# EAGLE design ES_Daisy_Patch_SM_Init_Rev1 (EAGLE 9.6.2)
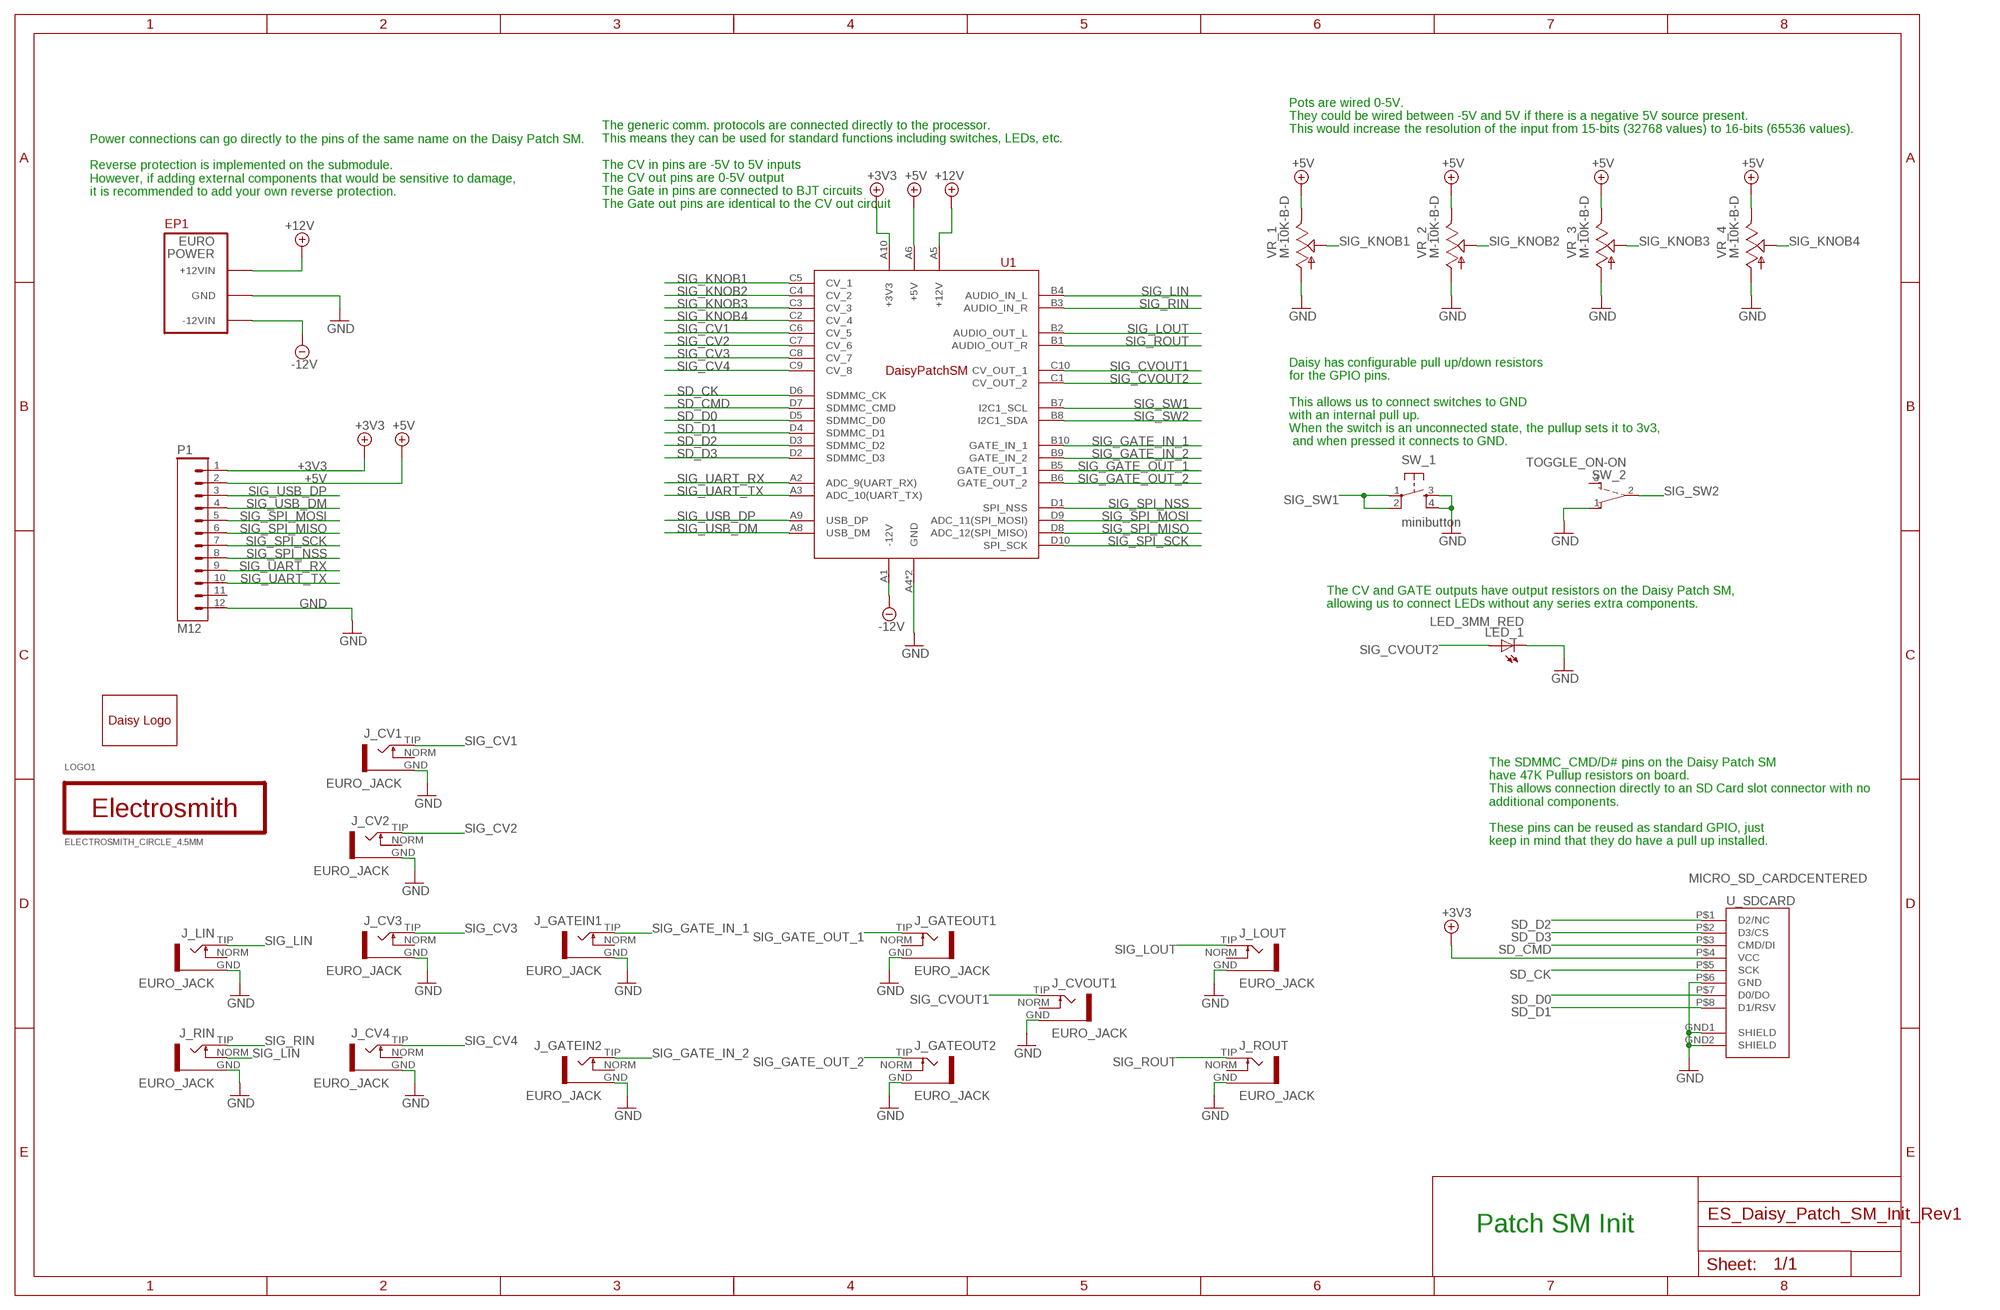
[diagram p0: schematic, sheet 1]

## Parts
EP1  EURORACK_POWERLOCK  [EURORACK_POWER_SHROUD_LOCK]
J_CV1  EURO_JACK  [S_JACK]
J_CV2  EURO_JACK  [S_JACK]
J_CV3  EURO_JACK  [S_JACK]
J_CV4  EURO_JACK  [S_JACK]
J_CVOUT1  EURO_JACK  [S_JACK]
J_GATEIN1  EURO_JACK  [S_JACK]
J_GATEIN2  EURO_JACK  [S_JACK]
J_GATEOUT1  EURO_JACK  [S_JACK]
J_GATEOUT2  EURO_JACK  [S_JACK]
J_LIN  EURO_JACK  [S_JACK]
J_LOUT  EURO_JACK  [S_JACK]
J_RIN  EURO_JACK  [S_JACK]
J_ROUT  EURO_JACK  [S_JACK]
LED_1  LED_3MM_RED  [LED]
LOGO1  ELECTROSMITH_CIRCLE_4.5MM  [ES_CIRCLE_4.5MM]
P1  M12  [1X12]
SW_1  minibutton  TAC_SWITCH_PTH_SILK  [TL1105SPF250Q_SILK]
SW_2  TOGGLE_ON-ON  [TOGGLE_ON-ON]
U1  ES_DAISY_PATCH_SM_REV1  [ES_DAISY_PATCH_SM_REV1]
U$2  DAISYLOGO  [ES_DAISY_LOGO_1]
U_SDCARD  MICRO_SD_CARDCENTERED  [VERT_MICROSD_CENTERED]
VR_1  M-10K-B-D  POT_9MM_SNAP-IN__  [9MM_SNAP-IN_POT_SILK]
VR_2  M-10K-B-D  POT_9MM_SNAP-IN__  [9MM_SNAP-IN_POT_SILK]
VR_3  M-10K-B-D  POT_9MM_SNAP-IN__  [9MM_SNAP-IN_POT_SILK]
VR_4  M-10K-B-D  POT_9MM_SNAP-IN__  [9MM_SNAP-IN_POT_SILK]

## Nets
+3V3 [power]: P1.1 U1.A10(+3V3) U_SDCARD.P$4(VCC)
+5V [power]: P1.2 U1.A6(+5V) VR_1.3 VR_2.3 VR_3.3 VR_4.3
+12V [power]: EP1.POS1(+12VIN) EP1.POS2(+12VIN) U1.A5(+12V)
-12V [power]: EP1.NEG1(-12VIN) EP1.NEG2(-12VIN) U1.A1(-12V)
GND [power]: EP1.GND1(GND) EP1.GND2(GND) EP1.GND3(GND) EP1.GND4(GND) EP1.GND5(GND) EP1.GND6(GND) J_CV1.GND J_CV2.GND J_CV3.GND J_CV4.GND J_CVOUT1.GND J_GATEIN1.GND J_GATEIN2.GND J_GATEOUT1.GND J_GATEOUT2.GND J_LIN.GND J_LOUT.GND J_RIN.GND J_ROUT.GND LED_1.K(C) P1.12 SW_1.3 SW_1.4 SW_2.1(O) U1.A4(GND) U1.A7(GND) U_SDCARD.GND1(SHIELD) U_SDCARD.GND2(SHIELD) U_SDCARD.P$6(GND) VR_1.1 VR_2.1 VR_3.1 VR_4.1
SD_CK: U1.D6(SDMMC_CK) U_SDCARD.P$5(SCK)
SD_CMD: U1.D7(SDMMC_CMD) U_SDCARD.P$3(CMD/DI)
SD_D0: U1.D5(SDMMC_D0) U_SDCARD.P$7(D0/DO)
SD_D1: U1.D4(SDMMC_D1) U_SDCARD.P$8(D1/RSV)
SD_D2: U1.D3(SDMMC_D2) U_SDCARD.P$1(D2/NC)
SD_D3: U1.D2(SDMMC_D3) U_SDCARD.P$2(D3/CS)
SIG_CV1: J_CV1.TIP U1.C6(CV_5)
SIG_CV2: J_CV2.TIP U1.C7(CV_6)
SIG_CV3: J_CV3.TIP U1.C8(CV_7)
SIG_CV4: J_CV4.TIP U1.C9(CV_8)
SIG_CVOUT1: J_CVOUT1.TIP U1.C10(CV_OUT_1)
SIG_CVOUT2: LED_1.A U1.C1(CV_OUT_2)
SIG_GATE_IN_1: J_GATEIN1.TIP U1.B10(GATE_IN_1)
SIG_GATE_IN_2: J_GATEIN2.TIP U1.B9(GATE_IN_2)
SIG_GATE_OUT_1: J_GATEOUT1.TIP U1.B5(GATE_OUT_1)
SIG_GATE_OUT_2: J_GATEOUT2.TIP U1.B6(GATE_OUT_2)
SIG_KNOB1: U1.C5(CV_1) VR_1.2
SIG_KNOB2: U1.C4(CV_2) VR_2.2
SIG_KNOB3: U1.C3(CV_3) VR_3.2
SIG_KNOB4: U1.C2(CV_4) VR_4.2
SIG_LIN: J_LIN.TIP J_RIN.NORM U1.B4(AUDIO_IN_L)
SIG_LOUT: J_LOUT.TIP U1.B2(AUDIO_OUT_L)
SIG_RIN: J_RIN.TIP U1.B3(AUDIO_IN_R)
SIG_ROUT: J_ROUT.TIP U1.B1(AUDIO_OUT_R)
SIG_SPI_MISO: P1.6 U1.D8(ADC_12(SPI_MISO))
SIG_SPI_MOSI: P1.5 U1.D9(ADC_11(SPI_MOSI))
SIG_SPI_NSS: P1.8 U1.D1(SPI_NSS)
SIG_SPI_SCK: P1.7 U1.D10(SPI_SCK)
SIG_SW1: SW_1.1 SW_1.2 U1.B7(I2C1_SCL)
SIG_SW2: SW_2.2(P) U1.B8(I2C1_SDA)
SIG_UART_RX: P1.9 U1.A2(ADC_9(UART_RX))
SIG_UART_TX: P1.10 U1.A3(ADC_10(UART_TX))
SIG_USB_DM: P1.4 U1.A8(USB_DM)
SIG_USB_DP: P1.3 U1.A9(USB_DP)
Unconnected: J_CV1.NORM J_CV2.NORM J_CV3.NORM J_CV4.NORM J_CVOUT1.NORM J_GATEIN1.NORM J_GATEIN2.NORM J_GATEOUT1.NORM J_GATEOUT2.NORM J_LIN.NORM J_LOUT.NORM J_ROUT.NORM P1.11 SW_2.3(S)

## Notes on the sheet
- Pots are wired 0-5V.
  They could be wired between -5V and 5V if there is a negative 5V source present. 
  This would increase the resolution of the input from 15-bits (32768 values) to 16-bits (65536 values).
- Power connections can go directly to the pins of the same name on the Daisy Patch SM.
  
  Reverse protection is implemented on the submodule. 
  However, if adding external components that would be sensitive to damage, 
  it is recommended to add your own reverse protection.
- The generic comm. protocols are connected directly to the processor.
  This means they can be used for standard functions including switches, LEDs, etc.
  
  The CV in pins are -5V to 5V inputs
  The CV out pins are 0-5V output
  The Gate in pins are connected to BJT circuits
  The Gate out pins are identical to the CV out circuit
- EP1
- Daisy has configurable pull up/down resistors 
  for the GPIO pins.
  
  This allows us to connect switches to GND
  with an internal pull up. 
  When the switch is an unconnected state, the pullup sets it to 3v3,
   and when pressed it connects to GND.
- The CV and GATE outputs have output resistors on the Daisy Patch SM,
  allowing us to connect LEDs without any series extra components.
- The SDMMC_CMD/D# pins on the Daisy Patch SM 
  have 47K Pullup resistors on board.
  This allows connection directly to an SD Card slot connector with no 
  additional components.
  
  These pins can be reused as standard GPIO, just 
  keep in mind that they do have a pull up installed.
- Patch SM Init

## Library data of the parts
EP1 = Electrosmith-Connectors:EURORACK_POWER; MPN: 2x5x.1-header
J_CV1-J_CV4 J_CVOUT1 J_GATEIN1 J_GATEIN2 J_GATEOUT1 J_GATEOUT2 J_LIN J_LOUT J_RIN J_ROUT = Electrosmith-Interface:EURO_JACK
LED_1 = Electrosmith-Interface:LED; COLOR: RED; SIZE: 3MM
LOGO1 = Electrosmith-Logo:ELECTROSMITH
P1 = Electrosmith-Connectors:M12
SW_1 = Electrosmith-Interface:TAC_SWITCH_PTH: Momentary Switch Button commonly used for reset or general input. Spark Fun Electronics SKU : COM-00097; IPN: Mini Button; MPN: TL1105SPF250Q
SW_2 = Electrosmith-Interface:TOGGLE_ON-ON
U1 = Electrosmith-Boards:ES_DAISY_PATCH_SM_REV1
U$2 = Electrosmith-Logo:DAISYLOGO
U_SDCARD = Electrosmith-Interface:MICRO_SD_CARD
VR_1-VR_4 = Electrosmith-Interface:POT_9MM_SNAP-IN_: 9mm vertical snap-in pot, Alpha / Panasonic style

## Net classes
0 default: width 0.203 mm, clearance 0.254 mm
1 power: width 0.406 mm, clearance 0.406 mm

## Board
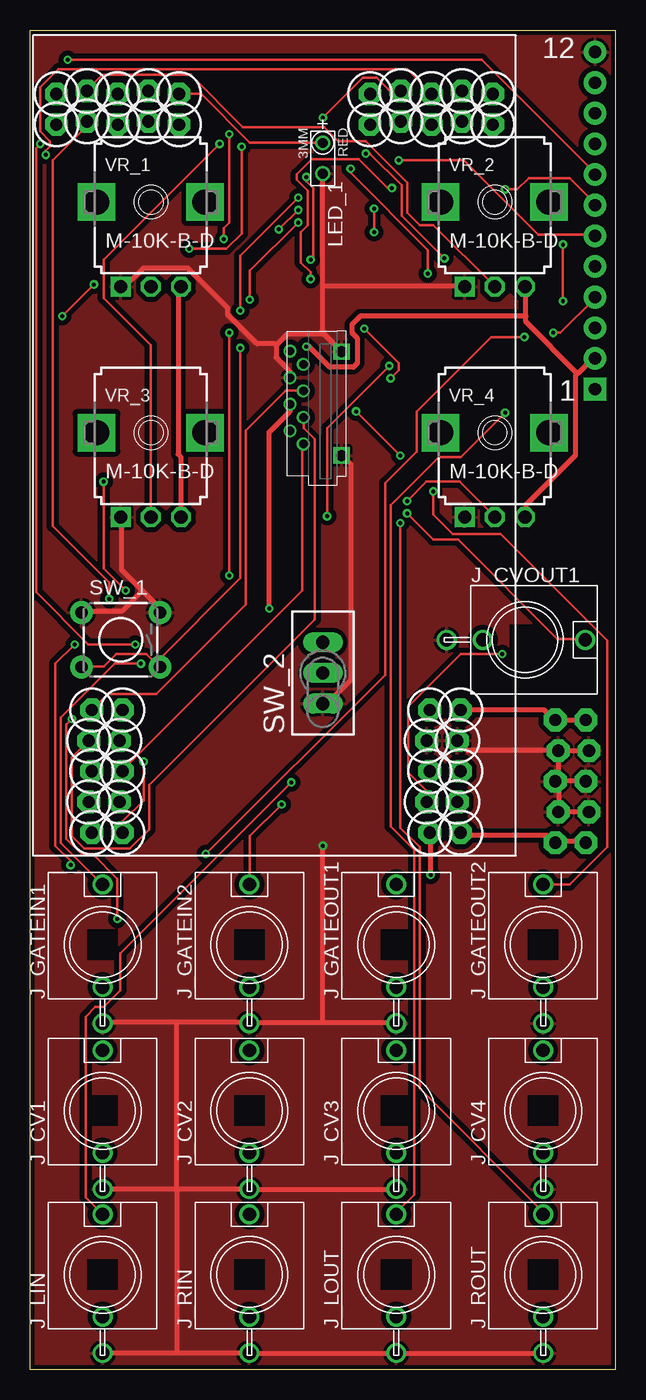
[diagram p1: board, top side]
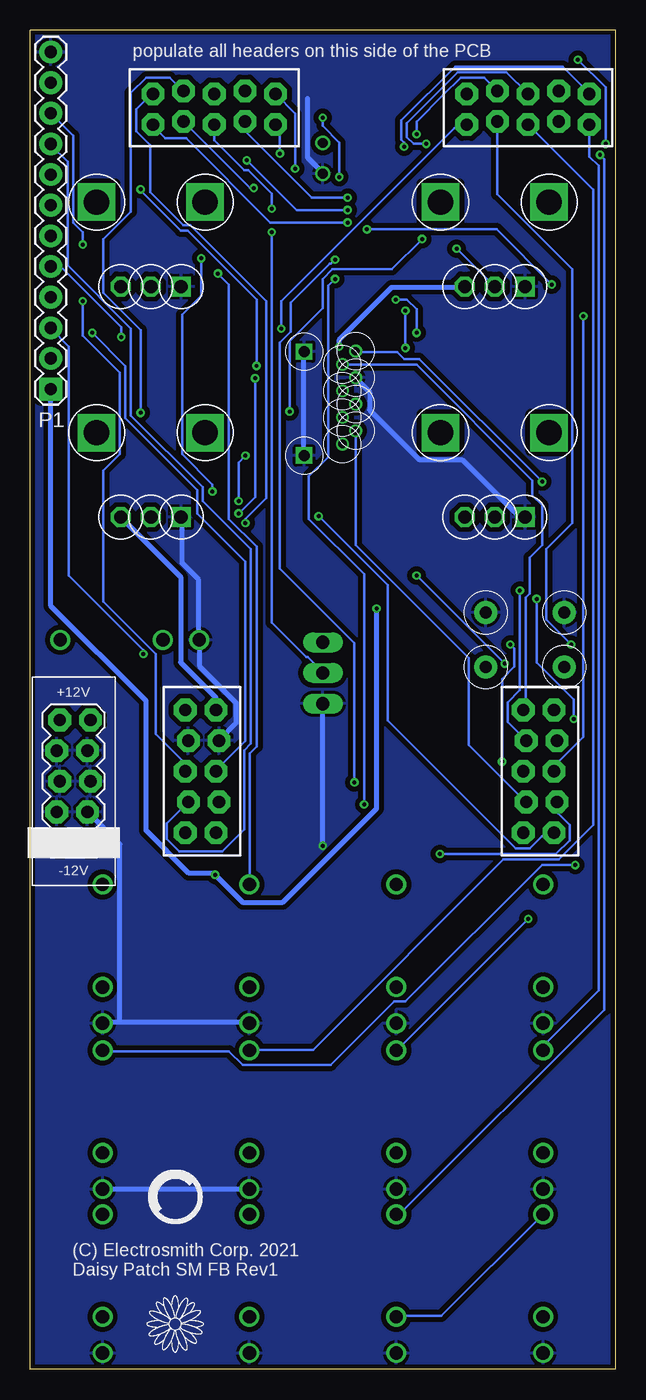
[diagram p2: board, bottom side, seen from below]

Size 48.5 x 111 mm. Coordinates in mm from the lower left corner, seen from the top.
Outline: 0,0 48.5,0 48.5,111 0,111 0,0
Copper layers (1*16): Top 0.0356mm / dielectric 1.5011mm / Bottom 0.0356mm
Design rules "ES_DRC_MaskedVias": minimum track width 6mil, minimum drill 13mil, track to track 6mil, track to pad 6mil, pad to pad 6mil, via to via 6mil, smd to smd 6mil, copper to edge 15mil, drill to drill 6mil, minimum pad ring 7mil, minimum via ring 7mil, stop-mask expansion 3mil, vias tented up to drill 16mil, thermal gap 10mil

### Footprints (pad centres in the part's own frame; a part is rotated, then mirrored left to right if it is on the bottom)
EURORACK_POWER_SHROUD_LOCK = drill 1.016 pad 1.88 octagon: GND1 -2.54,1.143; GND2 -2.54,-1.397; GND3 0,1.397; GND4 0,-1.143; GND5 2.54,1.143; GND6 2.54,-1.397; NEG1 5.08,1.397; NEG2 5.08,-1.143; POS1 -5.08,1.397; POS2 -5.08,-1.143
S_JACK = drill 1.1: GND 0,-6.5; NORM 0,-3.5; TIP 0,5
LED = drill 0.813: A -1.27,0; K 1.27,0
1X12 = drill 1.016 pad 1.88 square: 1 0,0 | drill 1.016 pad 1.88: 2 2.54,0; 3 5.08,0; 4 7.62,0; 5 10.16,0; 6 12.7,0; 7 15.24,0; 8 17.78,0; 9 20.32,0; 10 22.86,0; 11 25.4,0; 12 27.94,0
TL1105SPF250Q_SILK = drill 1.016 pad 1.88: 1 -3.251,2.261; 2 3.251,2.261; 3 -3.251,-2.261; 4 3.251,-2.261
TOGGLE_ON-ON = drill 1.1 pad 1.422 long: 1 -2.54,0; 2 0,0; 3 2.54,0
ES_DAISY_PATCH_SM_REV1 = drill 1.016 pad 1.88 octagon: A1 -32.08,-15.397; A2 -29.54,-15.143; A3 -27,-15.397; A4 -24.46,-15.143; A5 -21.92,-15.397; A6 -21.92,-12.857; A7 -24.46,-12.603; A8 -27,-12.857; A9 -29.54,-12.603; A10 -32.08,-12.857; B1 29.143,-18.08; B2 29.397,-15.54; B3 29.143,-13; B4 29.397,-10.46; B5 29.143,-7.92; B6 26.603,-7.92; B7 26.857,-10.46; B8 26.603,-13; B9 26.857,-15.54; B10 26.603,-18.08; C1 29.143,7.92; C2 29.397,10.46; C3 29.143,13; C4 29.397,15.54; C5 29.143,18.08; C6 26.603,18.08; C7 26.857,15.54; C8 26.603,13; C9 26.857,10.46; C10 26.603,7.92; D1 -32.08,12.603; D2 -29.54,12.857; D3 -27,12.603; D4 -24.46,12.857; D5 -21.92,12.603; D6 -21.92,15.143; D7 -24.46,15.397; D8 -27,15.143; D9 -29.54,15.397; D10 -32.08,15.143
VERT_MICROSD_CENTERED = drill 0.9 square: GND1 -3.9,-1.55; GND2 4.7,-1.55 | drill 0.7: P$1 -2.95,1.62; P$2 -1.85,2.72; P$3 -0.75,1.62; P$4 0.35,2.72; P$5 1.45,1.62; P$6 2.55,2.72; P$7 3.65,1.62; P$8 4.75,2.72
9MM_SNAP-IN_POT_SILK = drill 1.1 square: 1 -2.5,-7 | drill 1.1 octagon: 2 0,-7; 3 2.5,-7 | drill 2.1 square: CHASSIS1 -4.5,0; CHASSIS2 4.5,0

### Placement (x,y rotation side)
EP1  44.9,48.74 270 bottom
J_CV1  6,21.44 0 top
J_CV2  18.17,21.44 0 top
J_CV3  30.33,21.44 0 top
J_CV4  42.5,21.44 0 top
J_CVOUT1  41,60.47 270 top
J_GATEIN1  6,35.19 0 top
J_GATEIN2  18.17,35.19 0 top
J_GATEOUT1  30.33,35.19 0 top
J_GATEOUT2  42.5,35.19 0 top
J_LIN  6,7.85 0 top
J_LOUT  30.33,7.85 0 top
J_RIN  18.17,7.85 0 top
J_ROUT  42.5,7.85 0 top
LED_1  24.25,100.38 270 top
LOGO1  36.5,14.25 0 bottom
P1  46.8,81.25 90 bottom
SW_1  7.5,60.47 180 top
SW_2  24.25,57.72 90 top
U1  20.25,76.57 90 top
U$2  36.5,3.75 0 bottom
U_SDCARD  24.25,79.65 90 top
VR_1  10,96.75 0 top
VR_2  38.5,96.75 0 top
VR_3  10,77.64 0 top
VR_4  38.5,77.64 0 top

### Tracks (layer width: path | path; a pad name or v marks a point on that pad's centre or on a via)
+3V3  (via drill 0.33)
  Top 0.406: v19.8,63.06 19.8,77.69 21.52,79.4 21.52,79.97 U_SDCARD.P$4 | U1.A10 33.18,44.42 v33.18,41
  Bottom 0.406: v19.8,63.06 19.8,46.48 27.57,38.71 30.89,38.71 v33.18,41 33.29,41.11 35.35,41.11 38.89,44.66 38.89,55.4 46.78,63.29 46.78,81.23 P1.1
+5V  (via drill 0.33)
  Top 0.406: VR_3.3 12.49,70.72 12.49,75.63 12.26,75.86 12.26,89.46 12.49,89.69 VR_1.3 | 45.35,82.55 45.18,82.37 45.18,75.75 41.06,71.63 41.06,70.72 VR_4.3 | 41.06,87.29 41.06,86.83 45.35,82.55 | 41.06,87.29 41.06,89.69 VR_2.3 | v22.89,84.77 23.12,84.77 24.83,83.06 26.77,83.06 27.12,83.4 27.12,85.46 26.66,85.92 26.66,86.6 27.35,87.29 41.06,87.29 | P1.2 46.6,83.79 45.35,82.55
  Bottom 0.406: VR_4.3 40.95,70.6 36.03,65.69 36.03,58.6 33.11,55.67 U1.A6 | v22.89,84.77 22.89,85.35 18.55,89.69 12.6,89.69 VR_1.3
+12V
  Top 0.406: EP1.POS2 45.98,53.8 43.58,53.8 EP1.POS1 43.35,53.91 42.61,54.65 U1.A5
-12V
  Top 0.406: EP1.NEG2 45.98,43.74 43.58,43.74 EP1.NEG1 43.35,43.74 42.82,44.27 35.87,44.27 U1.A1
GND  (via drill 0.33)
  Top 0.406: 9.29,64.54 10.66,63.17 10.66,62.83 SW_1.3 | 9.29,64.54 7.57,66.26 7.57,70.6 VR_3.1 | 9.29,64.54 7.57,62.83 4.26,62.83 SW_1.4 | 20.37,84.89 20.37,83.86 21.52,82.72 21.52,82.26 U_SDCARD.P$6 | 20.37,84.89 21.29,85.8 24.26,85.8 | 24.26,85.8 24.38,85.8 25.75,84.43 U_SDCARD.GND2 | 24.26,85.8 24.26,89.8 | 24.26,89.8 24.26,99.06 LED_1.K | SW_2.1 24.26,55.28 24.72,55.28 26.55,57.11 26.55,75.06 25.86,75.75 U_SDCARD.GND1 | VR_1.1 7.57,89.8 7.91,89.8 9.4,91.29 13.06,91.29 16.37,87.97 16.37,87.4 18.77,85 20.26,85 20.37,84.89 | 24.26,89.8 35.92,89.8 VR_2.1 | EP1.GND3 43.58,48.77 45.98,48.77 EP1.GND4 | EP1.GND3 43.81,48.66 43.81,46.25 EP1.GND5 43.92,46.25 46.21,46.25 EP1.GND6 | EP1.GND1 43.81,51.17 43.81,48.88 EP1.GND3 | EP1.GND2 46.21,51.28 43.92,51.28 EP1.GND1 | EP1.GND1 43.58,51.28 36.22,51.28 U1.A4 | 12.14,28.77 18.09,28.77 J_GATEIN2.GND 18.32,28.77 24.26,28.77 | 12.14,28.77 6.09,28.77 J_GATEIN1.GND | 24.26,28.77 30.32,28.77 J_GATEOUT1.GND | 12.14,1.33 18.09,1.33 J_RIN.GND 18.32,1.33 30.32,1.33 J_LOUT.GND 30.43,1.33 42.43,1.33 J_ROUT.GND | 12.14,1.33 6.09,1.33 J_LIN.GND | 12.14,14.94 18.09,14.94 J_CV2.GND 18.32,14.94 30.32,14.94 J_CV3.GND | 12.14,14.94 6.09,14.94 J_CV1.GND | 12.14,14.94 12.14,1.33 | 12.14,14.94 12.14,28.77 | 24.26,28.77 v24.26,43.4
  Bottom 0.406: U_SDCARD.GND1 25.86,75.86 25.86,84.32 U_SDCARD.GND2 | 25.52,105.35 25.52,100.43 24.26,99.18 LED_1.K | VR_3.1 7.57,70.72 8.03,70.72 12.72,75.4 16.26,75.4 20.37,79.52 20.37,81 21.52,82.15 U_SDCARD.P$6 | VR_4.1 35.92,70.6 35.92,66.83 34.55,65.46 34.55,60.66 J_CVOUT1.GND 34.43,60.43 34.43,58.26 31.46,55.28 31.46,53.57 32.85,52.18 U1.A7 | 41.06,28.77 30.43,28.77 J_GATEOUT1.GND | 41.06,28.77 42.43,28.77 J_GATEOUT2.GND | J_CV4.GND 42.43,14.94 30.43,14.94 J_CV3.GND | 41.06,28.77 41.06,43.51 43.69,46.14 EP1.GND5 | v24.26,43.4 SW_2.1
  pour Top: 0.2,110.85 0.2,0.25 48.3,0.25 48.3,110.55 48.3,110.85
  pour Bottom: 0.5,110.75 0.5,0.25 48,0.25 48,110.25 48,110.75
SD_CK
  Top 0.203: U_SDCARD.P$5 22.55,81.12 21.17,81.12 17.86,77.8 17.86,63.4 10.43,55.97 6.43,55.97 U1.D6
SD_CMD
  Top 0.203: U_SDCARD.P$3 22.66,78.83 22.66,78.03 23.57,77.12 23.57,62.14 9.86,48.43 9.86,44.77 8.26,43.17 4.49,43.17 3.46,44.2 3.46,50.72 U1.D7
SD_D0
  Bottom 0.203: U_SDCARD.P$7 22.55,83.29 16.49,83.29 6.89,73.69 6.89,72.43 6.09,71.63 6.09,68.31 7.12,67.29 7.12,64.31 7.46,63.97 7.46,54.84 U1.D5
SD_D1  (via drill 0.33)
  Top 0.203: v6.09,73.57 6.09,66.37 v7.91,64.54
  Bottom 0.203: v6.09,73.57 16.26,83.75 17.52,83.75 18.09,84.32 21.52,84.32 U_SDCARD.P$8 | v7.91,64.54 7.91,56.31 8.94,55.28 8.94,53.71 8.94,53.69 8.94,53.66 U1.D4
SD_D2
  Top 0.203: U_SDCARD.P$1 22.55,76.66 22.55,64.54 7.65,49.64 U1.D3
SD_D3
  Bottom 0.203: U_SDCARD.P$2 21.52,77.69 21.52,68.31 12.14,58.94 12.14,51.74 7.43,47.03 U1.D2
SIG_CV1
  Bottom 0.203: J_CV1.TIP 5.97,26.48 5.97,26.82 1.4,31.4 1.4,99.75 2.17,100.52 U1.C6
SIG_CV2  (via drill 0.33)
  Top 0.203: v7.23,37.34 7.23,40.65 5.17,42.71 4.26,42.71 3,43.97 3,53.46 v3.46,53.91 | v6.54,63.86 6.54,65.23 1.86,69.91 1.86,100.2 4.6,102.95 4.6,103.32 U1.C7
  Bottom 0.203: v7.23,37.34 18.09,26.48 J_CV2.TIP | v3.46,53.91 3.46,55.51 6.54,58.6 v6.54,63.86
SIG_CV3
  Bottom 0.203: J_CV3.TIP 30.32,26.48 25.06,26.48 9.29,42.25 4.71,42.25 1.86,45.11 1.86,97.78 U1.C8
SIG_CV4  (via drill 0.33)
  Top 0.203: v3.34,41.8 3.34,42.14 2.09,43.4 2.09,58.48 v3.69,60.09
  Bottom 0.203: v3.34,41.8 6.09,41.8 17.4,30.48 18.32,30.48 23.57,25.22 30.89,25.22 32.03,26.37 42.43,26.37 J_CV4.TIP | v3.69,60.09 5.74,62.14 5.74,67.97 3.57,70.14 3.57,91.17 9.79,97.39 U1.C9
SIG_CVOUT1  (via drill 0.33)
  Top 0.203: v31.23,70.94 33.4,68.77 35.46,68.77 43.69,60.54 45.98,60.54 J_CVOUT1.TIP | v29.86,82.15 30.55,82.83 30.55,83.4 v27.69,86.26
  Bottom 0.203: v31.23,70.94 29.86,72.32 v29.86,82.15 | v27.69,86.26 27.69,88.55 13.38,102.86 13.17,103.06 13.06,103.17 U1.C10
SIG_CVOUT2
  Top 0.203: LED_1.A 24.15,101.69 18.2,101.69 14.18,105.71 U1.C1
SIG_GATE_IN_1  (via drill 0.33)
  Top 0.203: v9.17,58.48 7,58.48 2.54,54.03 2.54,43.63 5.97,40.2 J_GATEIN1.TIP | v16.49,85.92 v16.49,65.8 | v18.2,88.66 18.2,91.06 v22.2,95.06
  Bottom 0.203: v16.49,65.8 v9.17,58.48 | v16.49,85.92 16.49,87.86 17.29,88.66 v18.2,88.66 | v22.2,95.06 28.6,95.06 35.58,102.03 37.29,102.03 38.33,103.07 U1.B10
SIG_GATE_IN_2  (via drill 0.33)
  Top 0.203: v20.83,46.83 18.2,44.2 18.2,40.2 J_GATEIN2.TIP | v23.23,90.38 23.23,90.95 22.43,91.75 22.43,94.26 23,94.83 23,97.69 22.09,98.61 22.09,99.06 23.35,100.32 27.23,100.32 29.63,97.92 v29.98,97.92
  Bottom 0.203: v20.83,46.83 20.83,65.91 25.4,70.49 25.4,74.03 23.8,75.63 23.8,89.8 v23.23,90.38 | U1.B9 30.28,97.92 v29.98,97.92
SIG_GATE_OUT_1  (via drill 0.33)
  Top 0.203: v32.95,90.83 32.95,92.78 26.55,99.18 v26.55,99.52
  Bottom 0.203: v32.95,90.83 32.03,89.92 32.03,70.49 29.75,68.2 29.75,51.63 30.32,51.06 30.32,40.2 J_GATEOUT1.TIP | v26.55,99.52 26.55,104.09 U1.B5
SIG_GATE_OUT_2  (via drill 0.33)
  Top 0.203: v33.4,72.77 33.4,70.83 35.01,69.23 39.01,69.23 47.81,60.43 47.81,43.28 44.72,40.2 42.55,40.2 J_GATEOUT2.TIP | v34.32,92.09 30.77,95.63 30.77,98.15 28.15,100.78 v27.8,100.78
  Bottom 0.203: v33.4,72.77 33.4,73.34 35.92,75.86 35.92,87.4 34.32,89 v34.32,92.09 | v27.8,100.78 27.8,102.72 28.17,103.09 U1.B6
SIG_KNOB1  (via drill 0.33)
  Top 0.203: v13.17,92.89 16.26,92.89 17.52,94.15 v17.52,101.35
  Bottom 0.203: v13.17,92.89 10.09,89.8 VR_1.2 | v17.52,101.35 17.52,101.69 17.75,101.92 17.75,103.52 13.29,107.98 4.37,107.98 2.17,105.78 U1.C5
SIG_KNOB2
  Top 0.203: VR_2.2 38.43,89.8 33.4,94.83 32.26,94.83 31.23,95.86 31.23,98.38 27.8,101.81 25.52,101.81 24.38,102.95 17.63,102.95 13.29,107.29 5.97,107.29 4.71,106.03 U1.C4
SIG_KNOB3  (via drill 0.33)
  Top 0.203: v15.69,101.58 6.09,91.97 6.09,88.78 9.97,84.89 9.97,70.72 VR_3.2
  Bottom 0.203: v15.69,101.58 16.72,101.58 17.29,102.15 17.29,103.29 13.06,107.52 9.06,107.52 U1.C3
SIG_KNOB4  (via drill 0.33)
  Top 0.203: v31.23,71.97 32.83,73.57 35.58,73.57 38.43,70.72 VR_4.2 | v27,79.4 v30.66,75.75 | v16.03,93.69 16.03,94.6 16.49,95.06 v16.49,102.38
  Bottom 0.203: v31.23,71.97 31.23,75.17 v30.66,75.75 | v27,79.4 27,85.23 24.26,87.97 24.26,90.38 23.46,91.17 18.55,91.17 v16.03,93.69 | v16.49,102.38 16.49,103.41 14.26,105.64 12.83,107.06 10.89,107.06 U1.C2
SIG_LIN  (via drill 0.33)
  Top 0.203: v24.26,103.75 27.57,107.06 28.72,107.06 29.66,106.12 29.75,106.03 29.81,105.97 U1.B4 | v22.89,98.83 22.89,98.49 23.46,97.92 23.46,92.2 v23.23,91.97 | v21.63,48.66 7.46,34.48 7.46,31.4 6.09,30.03 5.4,30.03 4.6,29.22 4.6,14.25 5.97,12.88 J_LIN.TIP
  Bottom 0.203: J_RIN.NORM 18.09,4.42 14.43,4.42 6.09,12.77 J_LIN.TIP | v24.26,103.75 24.26,103.06 22.89,101.69 v22.89,98.83 | v23.23,91.97 23.57,91.63 23.69,91.63 26.89,88.43 26.89,86.03 27.8,85.12 27.8,66.37 21.63,60.2 v21.63,48.66
SIG_LOUT  (via drill 0.33)
  Top 0.203: v39.35,79.29 35.69,75.63 33.86,75.63 29.86,71.63 29.86,45 31.8,43.06 31.8,14.48 30.43,13.11 30.43,12.88 J_LOUT.TIP
  Bottom 0.203: v39.35,79.29 39.35,86.15 42.43,89.23 42.43,93.69 40.15,95.98 40.15,105.81 38.89,107.06 36.94,107.06 35.85,105.97 U1.B2
SIG_RIN  (via drill 0.33)
  Top 0.203: v1.29,100.66 1.29,101 1.63,101.35 1.63,101.81 0.83,102.61 0.83,106.26 2.31,107.75 31.23,107.75 33.25,105.73 U1.B3
  Bottom 0.203: v1.29,100.66 0.94,100.32 0.94,29.8 17.86,12.88 18.09,12.88 J_RIN.TIP
SIG_ROUT  (via drill 0.33)
  Top 0.203: v30.66,70.14 30.66,44.88 32.26,43.28 32.26,23.28 42.43,13.11 42.43,12.88 J_ROUT.TIP
  Bottom 0.203: v30.66,70.14 30.66,70.49 28.95,72.2 28.95,88.55 35.23,94.83 35.8,94.83 38.55,97.58 38.55,101.46 39.69,102.61 39.69,104.43 38.41,105.71 U1.B1
SIG_SPI_MISO  (via drill 0.33)
  Top 0.203: v5.29,89.92 v2.66,87.29 | v22.2,96.09 v20.6,94.49 | v30.55,100.2 35.92,100.2 42.09,94.03 46.72,94.03 P1.6
  Bottom 0.203: v2.66,87.29 2.66,52.43 5.11,49.98 U1.D8 | v5.29,89.92 9.86,94.49 v20.6,94.49 | v22.2,96.09 26.43,96.09 v30.55,100.2
SIG_SPI_MOSI  (via drill 0.33)
  Top 0.203: v14.54,42.71 29.4,57.57 29.4,73.46 32.03,76.09 32.03,79.4 38.2,85.57 v40.95,85.57
  Bottom 0.203: v14.54,42.71 4.94,42.71 3.8,43.86 3.8,45.11 4.75,46.06 4.75,46.92 U1.D9 | v40.95,85.57 40.95,86.37 45.98,91.4 P1.5
SIG_SPI_NSS  (via drill 0.33)
  Top 0.203: v9.4,50.37 9.4,47.17 7.65,45.42 U1.D1 | v8.72,60.09 4.83,60.09 0.49,64.43 0.49,101.23 v0.83,101.58 | v3.12,108.55 37.41,108.55 46.8,99.15 P1.8
  Bottom 0.203: v9.4,50.37 9.4,57.23 8.37,58.26 8.37,59.74 v8.72,60.09 | v0.83,101.58 0.83,106.26 v3.12,108.55
SIG_SPI_SCK  (via drill 0.33)
  Top 0.203: v24.6,70.72 24.6,78.03 v29.75,83.17 | v39.35,97.8 40.38,97.8 41.29,98.72 44.72,98.72 46.26,97.18 46.26,97.03 P1.7
  Bottom 0.203: v24.6,70.72 18.89,65 18.89,53.8 8.26,43.17 7.12,43.17 6.12,44.16 5.86,44.43 5.79,44.49 U1.D10 | v29.75,83.17 29.75,88.66 35.46,94.38 36.03,94.38 39.35,97.69 v39.35,97.8
SIG_SW1  (via drill 0.33)
  Top 0.203: SW_1.2 4.26,58.26 6.09,58.26 7.12,59.28 9.63,59.28 10.66,58.26 SW_1.1 10.43,58.6 17.4,65.57 v17.4,84.66 | v22.2,97.12 17.4,92.32 v17.4,87.75
  Bottom 0.203: v22.2,97.12 25.18,97.12 30.71,102.65 U1.B7 | v17.4,84.66 v17.4,87.75
SIG_SW2  (via drill 0.33)
  Top 0.203: v28.49,96.2 v28.49,94.26
  Bottom 0.203: v28.49,94.26 28.49,61.91 25.63,59.06 25.52,59.06 24.26,57.8 SW_2.2 | v28.49,96.2 28.49,97.46 30.43,99.41 30.77,99.41 33.25,101.88 U1.B8
SIG_UART_RX
  Bottom 0.203: P1.9 46.8,101.48 45.41,100.09 45.41,91.52 40.15,86.26 40.15,79.06 34.2,73.12 34.2,71.97 30.2,67.97 30.2,51.86 30.77,51.28 30.77,44.77 32.6,42.94 36.15,42.94 37.18,43.97 37.18,45.25 U1.A2
SIG_UART_TX  (via drill 0.33)
  Top 0.203: v44.15,93.23 v44.15,88.55
  Bottom 0.203: v44.15,88.55 44.15,85.69 41.06,82.6 41.06,75.86 42.43,74.49 42.43,63.63 38.09,59.28 38.09,52.66 35.65,50.21 U1.A3 | v44.15,93.23 44.15,94.26 44.95,95.06 44.95,102.26 P1.10
SIG_USB_DM  (via drill 0.33)
  Top 0.203: v43.35,85.92 43.92,85.92 46.8,88.8 P1.4
  Bottom 0.203: v43.35,85.92 40.6,83.17 40.6,78.83 34.66,72.89 34.66,70.94 30.66,66.94 30.66,52.08 33.11,49.64 U1.A8
SIG_USB_DP  (via drill 0.33)
  Top 0.203: v39.12,59.28 35.69,59.28 31.35,54.94 31.35,49.46 32.85,47.95 U1.A9
  Bottom 0.203: v39.12,59.28 39.12,59.63 45.29,65.8 45.29,84.77 46.8,86.28 P1.3

### Text on the board
tPlace: 12 | 1
bPlace: populate all headers on this side of the PCB | (C) Electrosmith Corp. 2021 / Daisy Patch SM FB Rev1
_tNames: VR_1 | VR_2 | LED_1 | VR_3 | VR_4 | P1 | SW_1 | J_CVOUT1 | SW_2 | J_GATEIN1 | J_GATEIN2 | J_GATEOUT1 | J_GATEOUT2 | J_CV1 | J_CV2 | J_CV3 | J_CV4 | J_LIN | J_RIN | J_LOUT | J_ROUT